# Altium schematic sheet Sheet4.SchDoc (part 3 of 3)
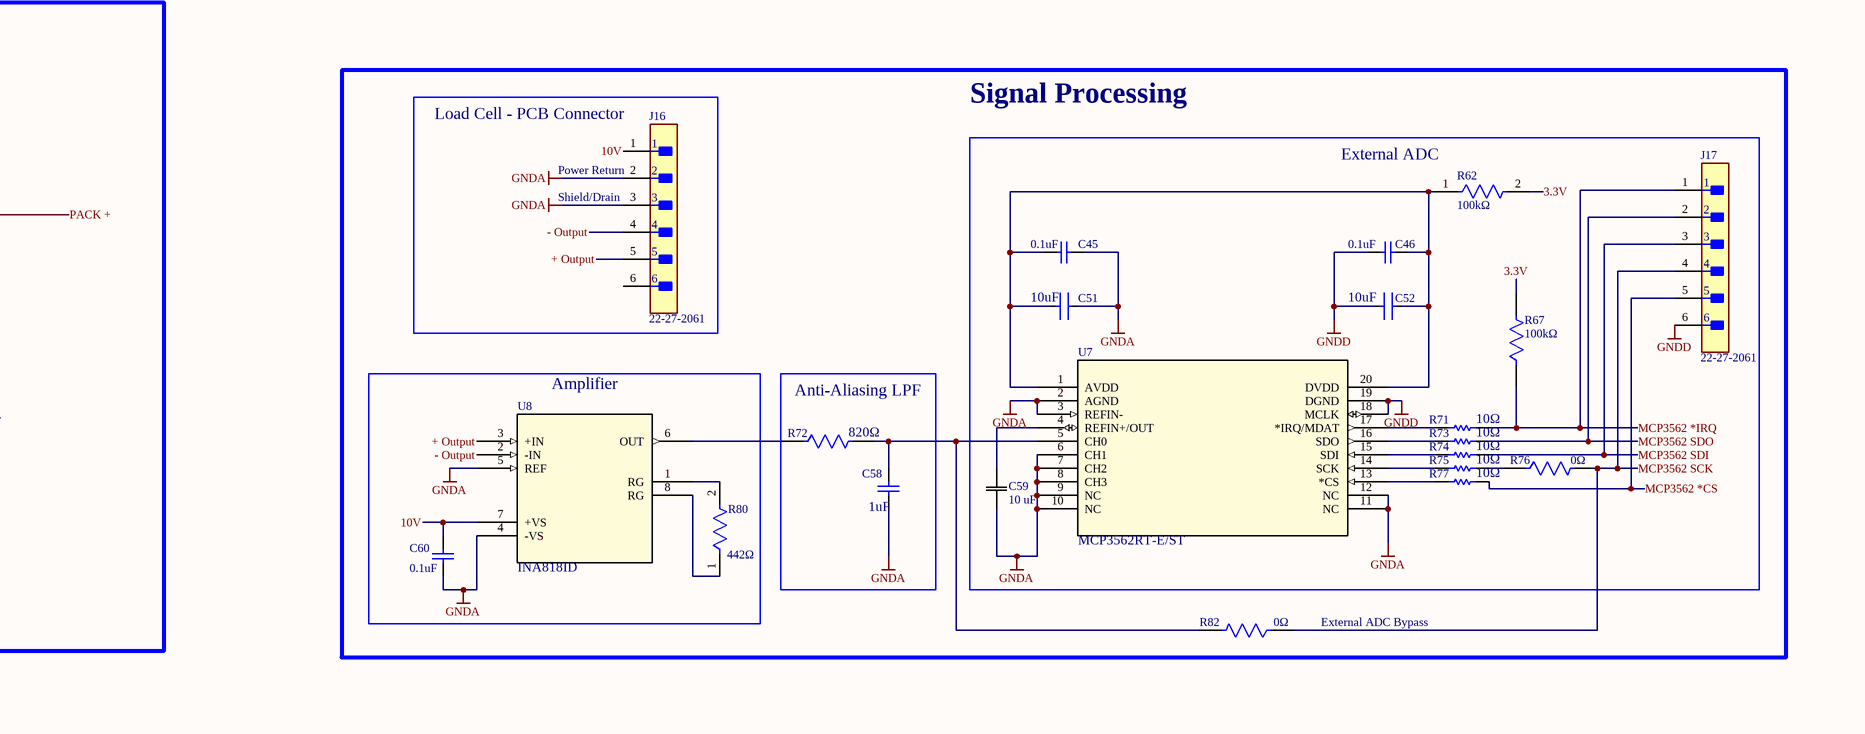
[diagram p5: Sheet4.SchDoc, bottom right]

## Library data of the parts (continued)
U3 = CMP-0136-00706-1: 150 mA, 28V LDO Regulator With Shutdown, 5-Pin SOT-23, Industrial Temperature, Tape and Reel; Code_IPC: SOT23-5; PackageVersion: revBB, Aug-2009; PackageDescription: 5-Lead Plastic Small Outline Transistor (OT) [SOT-23]; DatasheetVersion: revB, Nov-2009; PackageReference: SOT-23-OT5
U4 = NRF52832-QFAA-R7: Description; Manufacturer_Name: Nordic Semiconductor; Copyright: Copyright (C) 2025 Ultra Librarian. All rights reserved.; Manufacturer_Part_Number: NRF52832-QFAA-R7; RefDes: RefDes; Type: Type; Supplier 1: DigiKey; Supplier Part Number 1: 4823-NRF52832-QFAA-R7CT-ND
U5 = CMP-00252-82310923-1: PIC32MX274F256BT-I/SO MCU 32-bit MIPS32 M4K RISC 256KB Flash 2.5V/3.3V 28-Pin SOIC W T/R; Number of Timers/Counters: 5; Number of SPI Channels: 2; Interface: I2C, I2S, IrDA, LIN, Parallel, SPI, UART, USB; Number of A/D Converters: 1; Max Supply Voltage: 3.6V; Number of I/Os: 17; Frequency: 72MHz; Data Bus Width: 32b; Max Junction Temperature (Tj): 125°C; RAM Size: 64kB; Number of ADC Channels: 9; Min Supply Voltage: 2.5V; Schedule B: 8542310000, 8542310000; Min Operating Temperature: -40°C; RoHS: Non-Compliant; Number of USB Channels: 1; Number of PWM Channels: 5; Height: 2.65mm; Max Operating Temperature: 85°C; Number of UART Channels: 2; Number of I2C Channels: 2; Memory Size: 256kB; Memory Type: FLASH; Ambient Temperature Range High: 85°C; NexarPartId: 82310923; Lifecycle Status: Production
U6 = BQ24600RVAR: Standalone 1-6 cell Buck battery charge controller 16-VQFN -40 to 85; Manufacturer_Name: Texas Instruments; Part Reference: U3; Datasheet: https://www.ti.com/lit/gpn/bq24600; Manufacturer_Part_Number: BQ24600RVAR; Copyright: Copyright (C) 2025 Ultra Librarian. All rights reserved.; Value: BQ24600_RVA_16; Manufacturer Name: Texas Instruments; Manufacturer Part Number: BQ24600RVAR; Part Number: BQ24600RVAR; PCB Footprint: RVA16_2P14X2P14; Supplier 1: DigiKey; Supplier Part Number 1: 296-47740-1-ND
U7 = MCP3562RT-EST: Description; Manufacturer_Name: Microchip; Copyright: Copyright (C) 2025 Ultra Librarian. All rights reserved.; Manufacturer_Part_Number: MCP3562RT-E/ST; RefDes: RefDes; Type: Type; Supplier 1: DigiKey; Supplier Part Number 1: 150-MCP3562RT-E/STCT-ND
U8 = INA818ID: Low power (350-ÂµA), precision instrumentation amp with Â±60-V overvoltage protection (gain pins 1, 8) 8-SOIC -40 to 125; Manufacturer_Name: Texas Instruments; Copyright: Copyright (C) 2025 Ultra Librarian. All rights reserved.; Manufacturer_Part_Number: INA818ID; RefDes: RefDes; Type: Type; Supplier 1: DigiKey; Supplier Part Number 1: 296-INA818ID-ND
U9 = MP5035GJ-P: 2.9V to 22V 50mA to 2A Configurable Current-Limit Switch in a TSOT23-6 Package; Manufacturer_Name: Monolithic Power Systems; Copyright: Copyright (C) 2026 Ultra Librarian. All rights reserved.; Manufacturer_Part_Number: MP5035GJ-P; Datasheet: https://www.monolithicpower.com/en/documentview/productdocument/index/version/2/document_type/Datasheet/lang/en/sku/MP5035GJ; RefDes: RefDes; Type: Type; Supplier 1: DigiKey; Supplier Part Number 1: 1589-MP5035GJ-PCT-ND
U10 = STUSB4500LQTR: Standalone USB Type-C port controller for power sinking devices; Manufacturer_Name: STMicroelectronics; Part Reference: U9; Datasheet: https://www.st.com/resource/en/datasheet/stusb4500l.pdf; Manufacturer_Part_Number: STUSB4500LQTR; Copyright: Copyright (C) 2025 Ultra Librarian. All rights reserved.; Value: STUSB4500LQTR; PCB Footprint: QFN24_STUSB4500_STM; Part Number: STUSB4500LQTR; Manufacturer Part Number: STUSB4500LQTR; Manufacturer Name: STMicroelectronics; Supplier 1: Avnet; Supplier Part Number 1: STUSB4500QTR
U11 = ESDA25L: - Clamp - Ipp Tvs Diode Surface Mount SOT-23-3; PCB Footprint: SOT-23-3L; MF: STMicroelectronics; OriginalSymbolOrigin: (-40000,30000); SnapEDA_Link: https://www.snapeda.com/parts/ESDA25L/STMicroelectronics/view-part/?ref=snap; Package: SOT-23-3 STMicroelectronics; MP: ESDA25L; Check_prices: https://www.snapeda.com/parts/ESDA25L/STMicroelectronics/view-part/?ref=eda; Value: ESDA25L; Supplier 1: Avnet; Supplier Part Number 1: ESDA25L
X1 = FC-135 32.7680KA-A3: SMD Crystal 32.768KHz-12.5pF-20ppm-2P-3.2*1.5*0.9mm; Manufacturer_Name: Epson; Copyright: Copyright (C) 2025 Ultra Librarian. All rights reserved.; Manufacturer_Part_Number: FC-135 32.7680KA-A3; Supplier 1: Arrow Electronics; Supplier Part Number 1: FC-135 32.7680KA-A3
X2 = ECS-320-8-33B-7KM-TR: No Description Available; Manufacturer_Name: ECS International; Copyright: Copyright (C) 2026 Ultra Librarian. All rights reserved.; Manufacturer_Part_Number: ECS-320-8-33B-7KM-TR; RefDes: RefDes; Type: Type; Supplier 1: Avnet; Supplier Part Number 1: ECS-320-8-33B-7KM-TR
X3 = NX3225GD-8MHZ-STD-CRA-3: Description; Manufacturer_Name: NDK; Copyright: Copyright (C) 2025 Ultra Librarian. All rights reserved.; Manufacturer_Part_Number: NX3225GD-8MHZ-STD-CRA-3